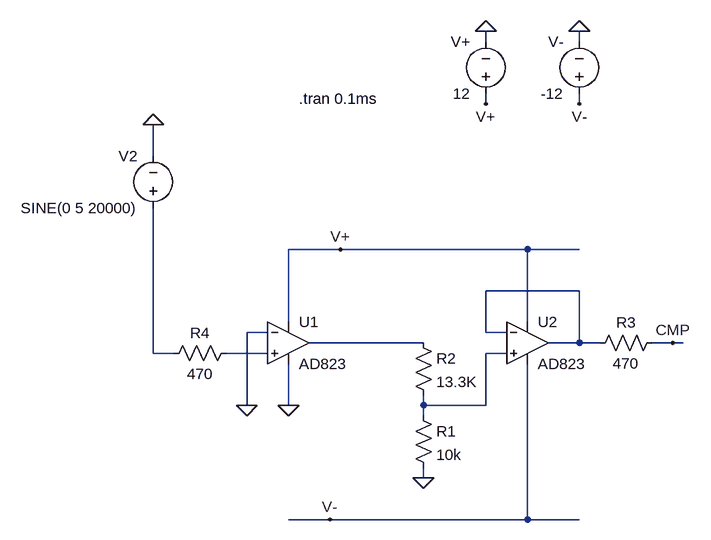
[diagram p0: schematic 823 CMP.asc]
823 CMP.asc, the LTspice schematic file:
Version 4
SHEET 1 1408 680
WIRE -320 -1376 -320 -1392
WIRE -176 -1376 -176 -1392
WIRE -320 -1280 -320 -1296
WIRE -176 -1280 -176 -1296
WIRE -832 -1200 -832 -1248
WIRE -544 -1056 -624 -1056
WIRE -256 -1056 -544 -1056
WIRE -176 -1056 -256 -1056
WIRE -176 -992 -320 -992
WIRE -624 -944 -624 -1056
WIRE -256 -944 -256 -1056
WIRE -656 -928 -688 -928
WIRE -320 -928 -320 -992
WIRE -288 -928 -320 -928
WIRE -416 -912 -592 -912
WIRE -176 -912 -176 -992
WIRE -176 -912 -224 -912
WIRE -144 -912 -176 -912
WIRE -32 -912 -64 -912
WIRE -16 -912 -32 -912
WIRE -832 -896 -832 -1120
WIRE -800 -896 -832 -896
WIRE -656 -896 -720 -896
WIRE -288 -896 -320 -896
WIRE -688 -816 -688 -928
WIRE -624 -816 -624 -880
WIRE -416 -816 -416 -832
WIRE -320 -816 -320 -896
WIRE -320 -816 -416 -816
WIRE -416 -800 -416 -816
WIRE -416 -704 -416 -720
WIRE -560 -640 -624 -640
WIRE -256 -640 -256 -880
WIRE -256 -640 -560 -640
WIRE -176 -640 -256 -640
FLAG -320 -1392 0
FLAG -688 -816 0
FLAG -832 -1248 0
FLAG -320 -1280 V+
FLAG -176 -1392 0
FLAG -176 -1280 V-
FLAG -544 -1056 V+
FLAG -416 -704 0
FLAG -32 -912 CMP
FLAG -560 -640 V-
FLAG -624 -816 0
SYMBOL voltage -320 -1280 R180
WINDOW 0 24 96 Left 2
WINDOW 3 24 16 Left 2
SYMATTR InstName V+
SYMATTR Value 12
SYMBOL voltage -832 -1104 R180
WINDOW 0 24 96 Left 2
WINDOW 3 24 16 Left 2
SYMATTR InstName V2
SYMATTR Value SINE(0 5 20000)
SYMBOL OpAmps/AD823 -624 -976 R0
SYMATTR InstName U1
SYMBOL OpAmps/AD823 -256 -976 R0
SYMATTR InstName U2
SYMBOL Res -704 -912 R90
WINDOW 0 0 56 VBottom 2
WINDOW 3 32 56 VTop 2
SYMATTR InstName R4
SYMATTR Value 470
SYMBOL voltage -176 -1280 R180
WINDOW 0 24 96 Left 2
WINDOW 3 24 16 Left 2
SYMATTR InstName V-
SYMATTR Value -12
SYMBOL Res -432 -816 R0
SYMATTR InstName R1
SYMATTR Value 10k
SYMBOL Res -432 -928 R0
SYMATTR InstName R2
SYMATTR Value 13.3K
SYMBOL Res -48 -928 R90
WINDOW 0 0 56 VBottom 2
WINDOW 3 32 56 VTop 2
SYMATTR InstName R3
SYMATTR Value 470
TEXT -608 -1288 Left 2 !.tran 0.1ms

The netlist it stands for:
* 823 CMP.asc
V+ V+ 0 12
V2 N003 0 SINE(0 5 20000)
XU1 N004 0 V+ 0 N002 AD823  ; pins In+ In- V+ V- OUT
XU2 N005 N001 V+ V- N001 AD823  ; pins In+ In- V+ V- OUT
R4 N004 N003 470
V- V- 0 -12
R1 N005 0 10k
R2 N002 N005 13.3K
R3 CMP N001 470
.tran 0.1ms
.lib ADI.lib
.backanno
.end